# Altium project ESC_type_4_000.PrjPcb
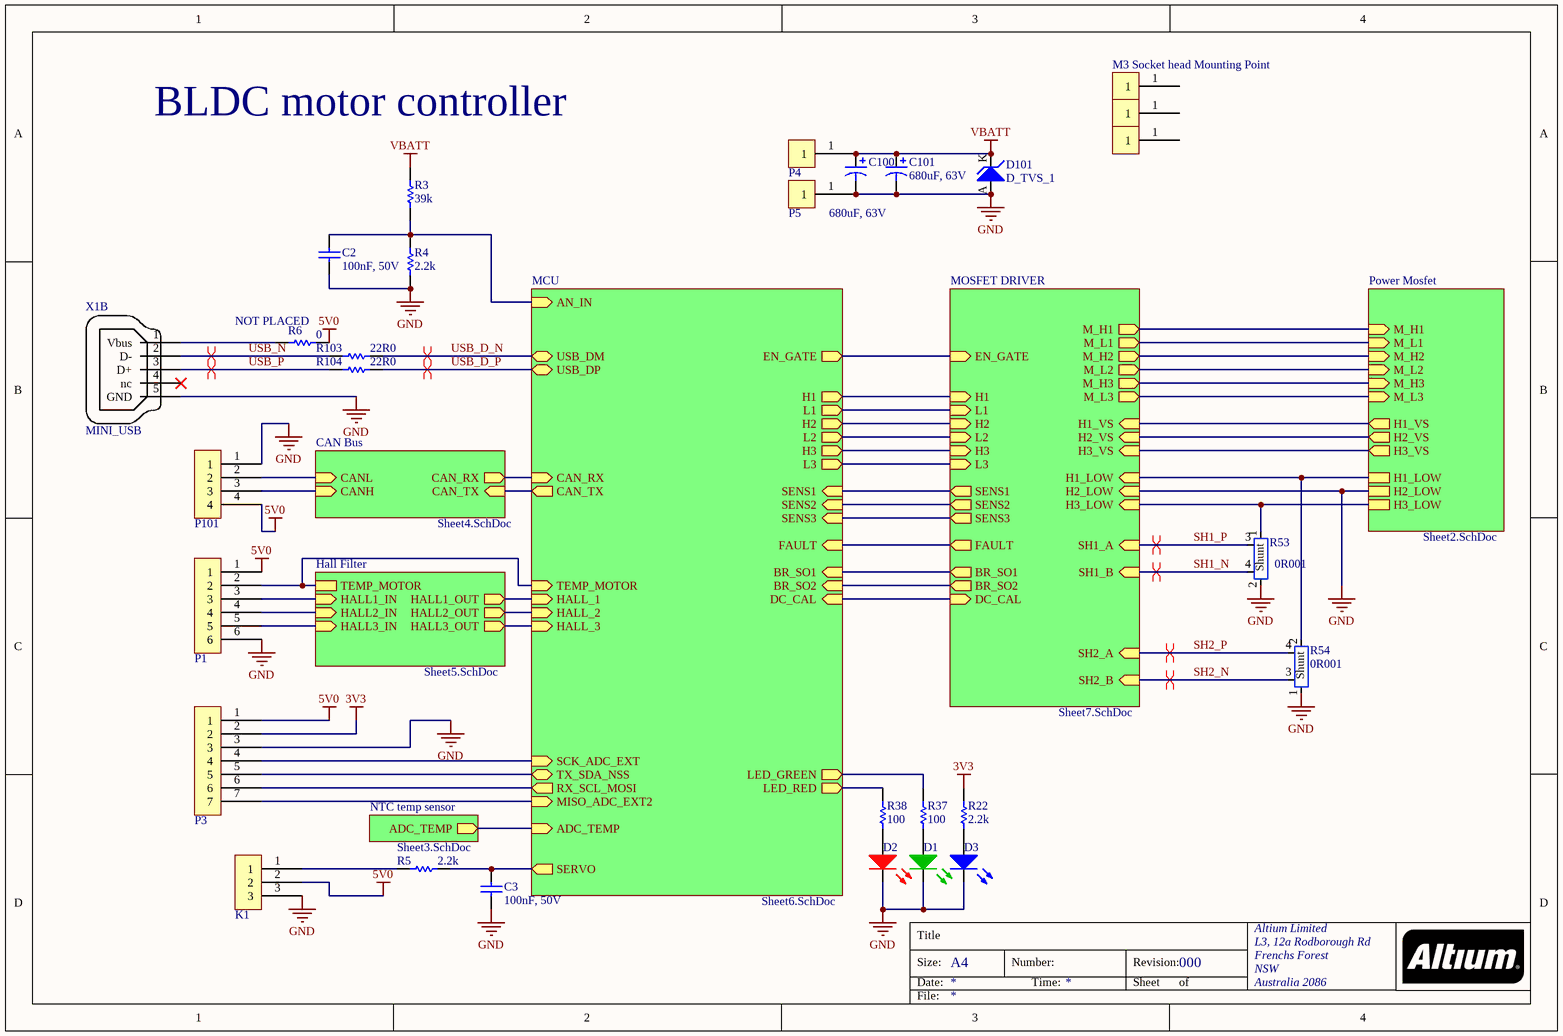
[diagram p0: Sheet1.SchDoc]
Revision: 000
7 sheets, 132 parts. Net scope: hierarchical (ports join the sheet entries above them; power ports are global).
Board file: ESC_type_4_000.PcbDoc
Sheets:
  Sheet1.SchDoc
    MOSFET DRIVER = Sheet7.SchDoc
    Power Mosfet = Sheet2.SchDoc
    MCU = Sheet6.SchDoc
    NTC temp sensor = Sheet3.SchDoc
    Hall Filter = Sheet5.SchDoc
    CAN Bus = Sheet4.SchDoc

## Sheet Sheet1.SchDoc
size A4; Organization: Altium Limited; Address1: L3, 12a Rodborough Rd; Address2: Frenchs Forest; Address3: NSW; Address4: Australia 2086

### Parts
C2  value 100nF, 50V  [SMD-0603 Capacitor]  (hidden comment: Voltage important)
C3  value 100nF, 50V  [SMD-0603 Capacitor]  (hidden comment: Voltage important)
C100  value 680uF, 63V  [ALU CAP 16DIA 25HIGH]  (hidden comment: CAP_POL)
C101  value 680uF, 63V  [ALU CAP 16DIA 25HIGH]  (hidden comment: CAP_POL)
D1  LED_GREEN  [SMD-0603 LED GREEN]  (value not drawn)
D2  LED_RED  [SMD-0603 LED RED]  (value not drawn)
D3  LED_BLUE  [SMD-0603 LED BLUE]  (value not drawn)
D101  D_TVS_1  [SMC-403-03]
K1  -  [HEADER 3 PIN]  (value not drawn)
M1  M3 Socket head Mounting Point  [M3 Socket head]
M2  M3 Socket head Mounting Point  [M3 Socket head]  (value not drawn)
M3  M3 Socket head Mounting Point  [M3 Socket head]  (value not drawn)
P1  B6B-PH-K-S(LF)(SN)  [JST PH TH VERT 6]  (value not drawn)
P3  B7B-PH-K-S(LF)(SN)  [JST PH TH VERT 7]  (value not drawn)
P4  -  [PAD1]  (value not drawn)
P5  -  [PAD1]  (value not drawn)
P101  B4B-PH-K-S(LF)(SN)  [JST PH TH VERT 4]  (value not drawn)
R3  39k  [SMD-0603 Resistor]
R4  2.2k  [SMD-0603 Resistor]
R5  2.2k  [SMD-0603 Resistor]
R6  0  Place (YES/NO): NOT PLACED  [SMD-0603 Resistor]
R22  2.2k  [SMD-0603 Resistor]
R37  100  [SMD-0603 Resistor]
R38  100  [SMD-0603 Resistor]
R53  0R001  [WSLP2726]
R54  0R001  [WSLP2726]
R103  22R0  [SMD-0603 Resistor]
R104  22R0  [SMD-0603 Resistor]
X1B  MINI_USB  [USB-MICRO B RA SMT-TH]

### Sub-sheets
CAN Bus = Sheet4.SchDoc: CANH (in), CANL (in), CAN_RX (out), CAN_TX (in)
Hall Filter = Sheet5.SchDoc: HALL3_IN (in), HALL2_IN (in), HALL1_IN (in), HALL3_OUT (out), HALL2_OUT (out), HALL1_OUT (out), TEMP_MOTOR
MCU = Sheet6.SchDoc: SENS3 (in), SENS2 (in), SENS1 (in), ADC_TEMP (in), SCK_ADC_EXT (in), MISO_ADC_EXT2 (in), H3 (out), H2 (out), H1 (out), USB_DM (bidir), USB_DP (bidir), BR_SO1 (in), BR_SO2 (in), SERVO (out), HALL_1 (in), HALL_2 (in), CAN_RX (in), CAN_TX (out), DC_CAL (in), L1 (out), L2 (out), L3 (out), TEMP_MOTOR (in), AN_IN (in), LED_GREEN (out), LED_RED (out), TX_SDA_NSS (bidir), RX_SCL_MOSI (out), EN_GATE (out), HALL_3 (in), FAULT (in)
MOSFET DRIVER = Sheet7.SchDoc: FAULT (out), DC_CAL (in), EN_GATE (in), H1 (in), L1 (in), H2 (in), L2 (in), H3 (in), L3 (in), BR_SO1 (out), BR_SO2 (out), M_H1 (out), M_L1 (out), H1_LOW (in), M_H2 (out), H2_VS (in), M_L2 (out), H2_LOW (in), M_H3 (out), H3_VS (in), M_L3 (out), H3_LOW (in), SH1_A (in), SH1_B (in), SH2_A (in), SH2_B (in), SENS1 (out), SENS2 (out), H1_VS (in), SENS3 (out)
NTC temp sensor = Sheet3.SchDoc: ADC_TEMP (out)
Power Mosfet = Sheet2.SchDoc: H1_VS (out), M_H1 (in), M_L1 (in), H1_LOW, H2_VS (out), M_H2 (in), M_L2 (in), H2_LOW, H3_VS (out), M_H3 (in), M_L3 (in), H3_LOW

### Nets
3V3: P3.2 R22.2
5V0: K1.2 P1.1 P3.1 P101.4 R6.2
GND: C2.2 C3.1 C100.2 C101.2 D1.2 D2.2 D3.2 D101.A K1.3 P1.6 P3.3 P5.1 P101.1 R4.1 R53.2 R54.1 X1B.5(GND) ; sheet MOSFET DRIVER/H2_LOW, sheet Power Mosfet/H2_LOW
VBATT: C100.1 C101.1 D101.K P4.1 R3.2
H1_VS: sheet MOSFET DRIVER/H1_VS, sheet Power Mosfet/H1_VS
H2_VS: sheet MOSFET DRIVER/H2_VS, sheet Power Mosfet/H2_VS
H3_VS: sheet MOSFET DRIVER/H3_VS, sheet Power Mosfet/H3_VS
RX_SCL_MOSI: P3.6 ; sheet MCU/RX_SCL_MOSI
SH1_N: R53.4 ; sheet MOSFET DRIVER/SH1_B
SH1_P: R53.3 ; sheet MOSFET DRIVER/SH1_A
SH2_N: R54.3 ; sheet MOSFET DRIVER/SH2_B
SH2_P: R54.4 ; sheet MOSFET DRIVER/SH2_A
TX_SDA_NSS: P3.5 ; sheet MCU/TX_SDA_NSS
USB_D_N: R103.2 ; sheet MCU/USB_DM
USB_D_P: R104.2 ; sheet MCU/USB_DP
USB_N: R103.1 X1B.2(D-)
USB_P: R104.1 X1B.3(D+)
NetC2_1: C2.1 R3.1 R4.2 ; sheet MCU/AN_IN
NetC3_2: C3.2 R5.2 ; sheet MCU/SERVO
NetC4_2: P1.2 ; sheet MCU/TEMP_MOTOR, sheet Hall Filter/TEMP_MOTOR
NetC5_2: sheet MCU/HALL_3, sheet Hall Filter/HALL3_OUT
NetC6_2: sheet MCU/HALL_2, sheet Hall Filter/HALL2_OUT
NetC7_2: sheet MCU/HALL_1, sheet Hall Filter/HALL1_OUT
NetC41_2: sheet MCU/ADC_TEMP, sheet NTC temp sensor/ADC_TEMP
NetC102_2: R54.2 ; sheet MOSFET DRIVER/H1_LOW, sheet Power Mosfet/H1_LOW
NetC106_2: R53.1 ; sheet MOSFET DRIVER/H3_LOW, sheet Power Mosfet/H3_LOW
NetD1_1: D1.1 R37.1
NetD2_1: D2.1 R38.1
NetD3_1: D3.1 R22.1
NetK1_1: K1.1 R5.1
NetP1_3: P1.3 ; sheet Hall Filter/HALL1_IN
NetP1_4: P1.4 ; sheet Hall Filter/HALL2_IN
NetP1_5: P1.5 ; sheet Hall Filter/HALL3_IN
NetP3_4: P3.4 ; sheet MCU/SCK_ADC_EXT
NetP3_7: P3.7 ; sheet MCU/MISO_ADC_EXT2
NetP101_2: P101.2 ; sheet CAN Bus/CANL
NetP101_3: P101.3 ; sheet CAN Bus/CANH
NetR6_1: R6.1 X1B.1(Vbus)
NetR23_1: sheet MOSFET DRIVER/SENS1, sheet MCU/SENS1
NetR26_1: sheet MOSFET DRIVER/SENS2, sheet MCU/SENS2
NetR28_1: sheet MOSFET DRIVER/M_H1, sheet Power Mosfet/M_H1
NetR29_1: sheet MOSFET DRIVER/M_L1, sheet Power Mosfet/M_L1
NetR32_1: sheet MOSFET DRIVER/SENS3, sheet MCU/SENS3
NetR34_1: sheet MOSFET DRIVER/M_H2, sheet Power Mosfet/M_H2
NetR35_1: sheet MOSFET DRIVER/M_L2, sheet Power Mosfet/M_L2
NetR37_2: R37.2 ; sheet MCU/LED_GREEN
NetR38_2: R38.2 ; sheet MCU/LED_RED
NetR42_1: sheet MOSFET DRIVER/M_H3, sheet Power Mosfet/M_H3
NetR43_1: sheet MOSFET DRIVER/M_L3, sheet Power Mosfet/M_L3
NetU1_26: sheet MOSFET DRIVER/BR_SO2, sheet MCU/BR_SO2
NetU1_27: sheet MOSFET DRIVER/BR_SO1, sheet MCU/BR_SO1
NetU1_33: sheet MOSFET DRIVER/DC_CAL, sheet MCU/DC_CAL
NetU1_34: sheet MOSFET DRIVER/L3, sheet MCU/L3
NetU1_35: sheet MOSFET DRIVER/L2, sheet MCU/L2
NetU1_36: sheet MOSFET DRIVER/L1, sheet MCU/L1
NetU1_41: sheet MOSFET DRIVER/H3, sheet MCU/H3
NetU1_42: sheet MOSFET DRIVER/H2, sheet MCU/H2
NetU1_43: sheet MOSFET DRIVER/H1, sheet MCU/H1
NetU1_51: sheet MOSFET DRIVER/EN_GATE, sheet MCU/EN_GATE
NetU1_53: sheet MOSFET DRIVER/FAULT, sheet MCU/FAULT
NetU1_61: sheet MCU/CAN_RX, sheet CAN Bus/CAN_RX
NetU1_62: sheet MCU/CAN_TX, sheet CAN Bus/CAN_TX

Not connected (* = marked no-connect by the designer): M1 1; M2 1; M3 1; X1B 4(nc)*

### Layout directives
differential pair: SH1_N, SH1_P, SH2_N, SH2_P, USB_D_N, USB_D_P, USB_N, USB_P

### Notes on the sheet
- BLDC motor controller
- Title
- Size:
- Date:
- A4
- Number:
- Time:
- Revision:
- Sheet
- of
- File:
- (in symbol 13) Shunt
- (in symbol 14) Shunt

### Library data of the parts
C2 C3 = 7: CAP 100n, 50V, 0603; Manufacturer Part Number: 06035C104JAT2A; Manufacturer: AVX Corporation; ID: 7; Place (YES/NO): YES
C100 C101 = 21: 680µF 63V Aluminum Capacitors Radial; Manufacturer Part Number: UPW1J681MHD; Manufacturer: Nichicon; ID: 21; Place (YES/NO): YES
D1 = 1: LED Green, 0603; Part Number: LTST-C191KGKT; Manufacturer: Lite-On Inc.; ID: 1; Place (YES/NO): YES; Manufacturer Part Number: LTST-C191KGKT
D2 = 2: LED Red, 0603; Part Number: LTST-C191KRKT; Manufacturer: Lite-On Inc.; ID: 2; Place (YES/NO): YES; Manufacturer Part Number: LTST-C191KRKT
D3 = 3: LED Blue, 0603; Part Number: LBQ39GN1P1351; Manufacturer: OSRAM; ID: 3; Place (YES/NO): YES; Manufacturer Part Number: LBQ39GN1P1351
D101 = 16: TVS DIODE 51VWM 82.4VC SMC; Manufacturer Part Number: SMCJ51A; Manufacturer: ON Semiconductor; ID: 16; Value: 51V; Place (YES/NO): YES
K1 = 6: Breakaway 3 pin Through hole; ID: 6; Place (YES/NO): YES; Manufacturer Part Number: -; Manufacturer: -
M1-M3 = 1: ID: 1; Place (YES/NO): yes; Value: M3
P1 = 3: JST PH Through hole Vertical 6 Pin; ID: 3; Value: JST PH 6 PIN; Place (YES/NO): YES; Manufacturer Part Number: B6B-PH-K-S(LF)(SN); Manufacturer: JST
P3 = 4: JST PH Through hole Vertical 7 Pin; ID: 4; Value: JST PH 4 PIN; Place (YES/NO): YES; Manufacturer Part Number: B7B-PH-K-S(LF)(SN); Manufacturer: JST
P4 P5 = 1: SMD Power landing; ID: 1; Value: -; Place (YES/NO): -; Manufacturer Part Number: -; Manufacturer: -
P101 = 2: JST PH Through hole Vertical 4 Pin; ID: 2; Value: JST PH 4 PIN; Place (YES/NO): YES; Manufacturer Part Number: B4B-PH-K-S(LF)(SN); Manufacturer: JST
R3 = 8: R 39k, 0603; Manufacturer Part Number: ERJ-3EKF3902V; Manufacturer: Panasonic Electronic Components; ID: 8; Place (YES/NO): YES; Value: 39k
R4 R5 R22 = 3: R 2.2k, 0603; Manufacturer Part Number: RK73H1JTTD2201F; Manufacturer: KOA Speer; ID: 3; Place (YES/NO): YES; Value: 2.2k
R6 = 16: R 0 ohm, 0603; Manufacturer: KOA Speer; ID: 16; Value: 0
R37 R38 = 2: R 100ohm, 0603; Manufacturer Part Number: RK73H1JTTD1000F; Manufacturer: KOA Speer; ID: 2; Place (YES/NO): YES; Value: 100
R53 = 13: Shunt 1mOhm; Manufacturer Part Number: WSLP27261L000FEA; Manufacturer: Vishay Dale; ID: 13; Place (YES/NO): YES; Value: 0R001
R54 = 14: Shunt 1mOhm MIRROR; Manufacturer Part Number: WSLP27261L000FEA; Manufacturer: Vishay Dale; ID: 14; Place (YES/NO): YES; Value: 0R001
R103 R104 = 12: R 22R, 0603; Manufacturer Part Number: RK73H1JTTD22R0F; Manufacturer: KOA Speer; ID: 12; Place (YES/NO): YES; Value: 22R0
X1B = 39: CONN USB MICRO B RECPT SMT R/A TH; Manufacturer Part Number: 10118194-0001LF; Manufacturer: Amphenol FCI; ID: 39; Value: Micro-USB; Place (YES/NO): YES

## Sheet Sheet7.SchDoc
size A4; Organization: Altium Limited; Address1: L3, 12a Rodborough Rd; Address2: Frenchs Forest; Address3: NSW; Address4: Australia 2086
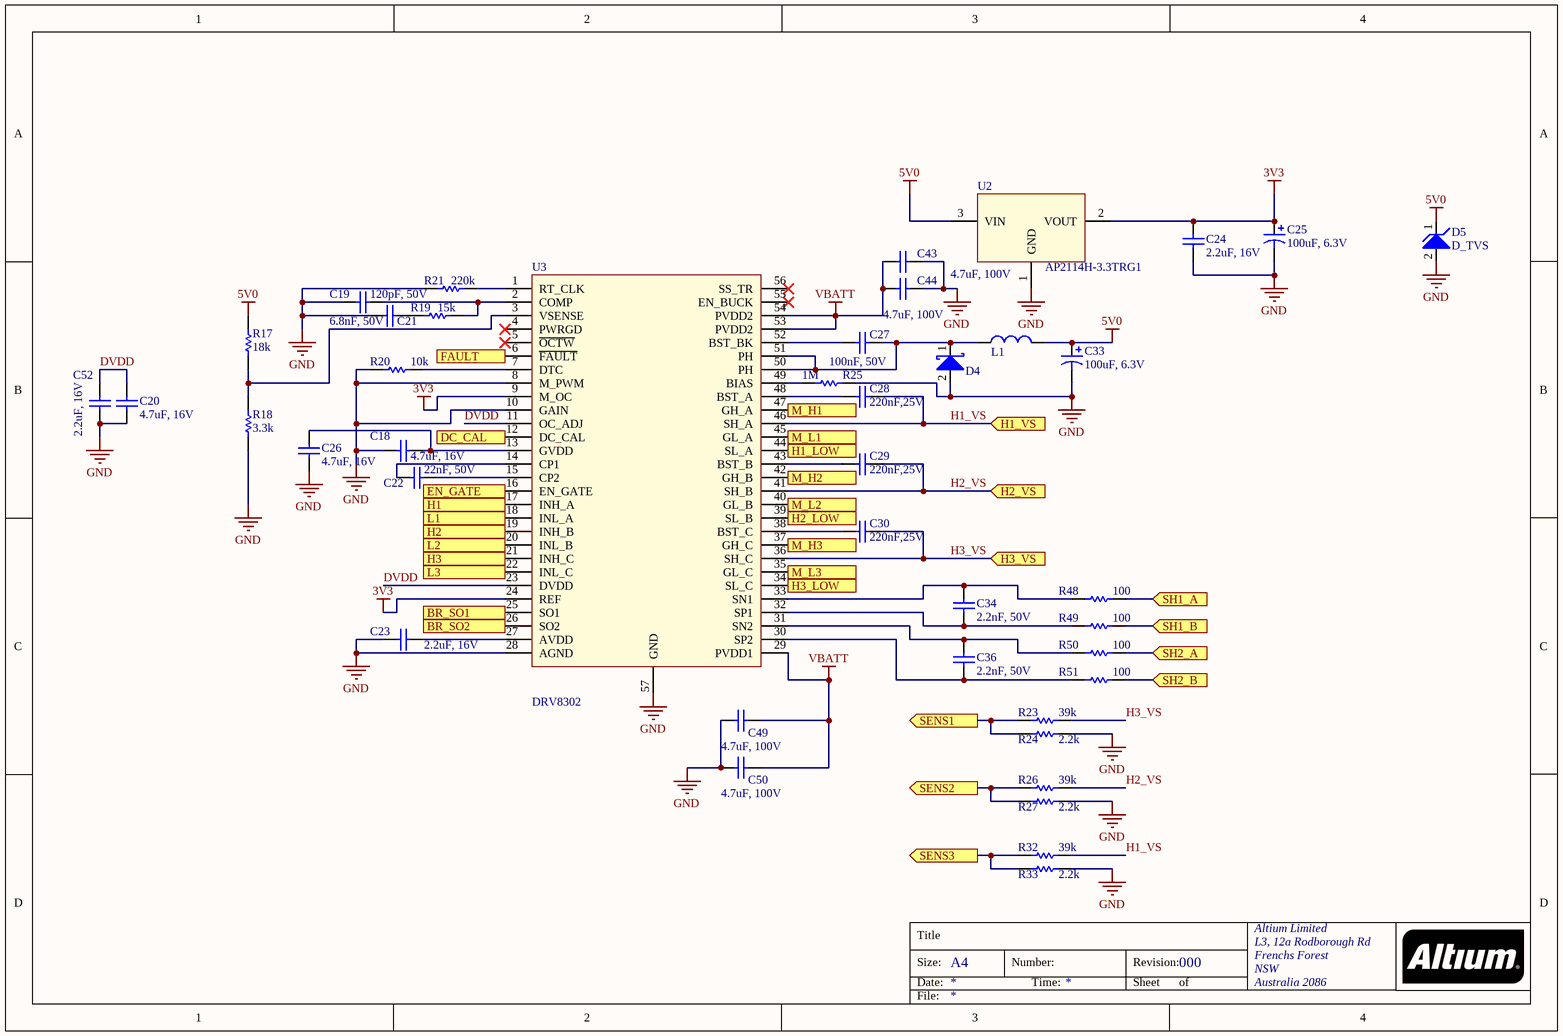
[diagram p1: Sheet7.SchDoc]

### Parts
C18  value 4.7uF, 16V  [SMD-0603 Capacitor]  (hidden comment: CAP)
C19  value 120pF, 50V  [SMD-0603 Capacitor]  (hidden comment: CAP)
C20  value 4.7uF, 16V  [SMD-0603 Capacitor]  (hidden comment: CAP)
C21  value 6.8nF, 50V  [SMD-0603 Capacitor]  (hidden comment: CAP)
C22  value 22nF, 50V  [SMD-0603 Capacitor]  (hidden comment: CAP)
C23  value 2.2uF, 16V  [SMD-0603 Capacitor]  (hidden comment: Voltage important)
C24  value 2.2uF, 16V  [SMD-0603 Capacitor]  (hidden comment: Voltage important)
C25  value 100uF, 6.3V  [TANT B]  (hidden comment: Voltage important)
C26  value 4.7uF, 16V  [SMD-0603 Capacitor]  (hidden comment: CAP)
C27  value 100nF, 50V  [SMD-0603 Capacitor]  (hidden comment: Voltage important)
C28  value 220nF,25V  [SMD-0603 Capacitor]  (hidden comment: Voltage important)
C29  value 220nF,25V  [SMD-0603 Capacitor]  (hidden comment: Voltage important)
C30  value 220nF,25V  [SMD-0603 Capacitor]  (hidden comment: Voltage important)
C33  value 100uF, 6.3V  [TANT B]  (hidden comment: Voltage important)
C34  value 2.2nF, 50V  [SMD-0603 Capacitor]  (hidden comment: CAP)
C36  value 2.2nF, 50V  [SMD-0603 Capacitor]  (hidden comment: CAP)
C43  value 4.7uF, 100V  [SMD-1206 Capacitor]  (hidden comment: CAP)
C44  value 4.7uF, 100V  [SMD-1206 Capacitor]  (hidden comment: CAP)
C49  value 4.7uF, 100V  [SMD-1206 Capacitor]  (hidden comment: CAP)
C50  value 4.7uF, 100V  [SMD-1206 Capacitor]  (hidden comment: CAP)
C52  value 2.2uF, 16V  [SMD-0603 Capacitor]  (hidden comment: Voltage important)
D4  Voltage and current important  [SOD-123W]  (value not drawn)
D5  D_TVS  [DO-214AC]
L1  COIL  [HCM0503]  (value not drawn)
R17  18k  [SMD-0603 Resistor]
R18  3.3k  [SMD-0603 Resistor]
R19  15k  [SMD-0603 Resistor]
R20  10k  [SMD-0603 Resistor]
R21  220k  [SMD-0603 Resistor]
R23  39k  [SMD-0603 Resistor]
R24  2.2k  [SMD-0603 Resistor]
R25  1M  [SMD-0603 Resistor]
R26  39k  [SMD-0603 Resistor]
R27  2.2k  [SMD-0603 Resistor]
R32  39k  [SMD-0603 Resistor]
R33  2.2k  [SMD-0603 Resistor]
R48  100  [SMD-0603 Resistor]
R49  100  [SMD-0603 Resistor]
R50  100  [SMD-0603 Resistor]
R51  100  [SMD-0603 Resistor]
U2  Manufacturer Part Number: AP2114H-3.3TRG1  [SOT230P700X180-4N]  (hidden comment: 3.3V)
U3  DRV8302  [SOP127P600-8N]

### Ports
BR_SO1 (out), BR_SO2 (out), DC_CAL (in), EN_GATE (in), FAULT (out), H1 (in), H1_LOW (in), H1_VS (in), H2 (in), H2_LOW (in), H2_VS (in), H3 (in), H3_LOW (in), H3_VS (in), L1 (in), L2 (in), L3 (in), M_H1 (out), M_H2 (out), M_H3 (out), M_L1 (out), M_L2 (out), M_L3 (out), SENS1 (out), SENS2 (out), SENS3 (out), SH1_A (in), SH1_B (in), SH2_A (in), SH2_B (in)

### Nets
3V3: C24.2 C25.1 U2.2(VOUT) U3.9(M_OC) U3.24(REF)
5V0: C33.1 D5.1(K) L1.2 R17.2 U2.3(VIN)
GND: C18.2 C19.1 C20.1 C21.1 C23.1 C24.1 C25.2 C26.1 C33.2 C43.1 C44.1 C49.2 C50.2 C52.1 D4.2(A) D5.2(A) R18.1 R20.1 R21.1 R24.2 R25.2 R27.2 R33.2 U2.1(GND) U3.8(M_PWM) U3.10(GAIN) U3.28(AGND) U3.39(SL_B) U3.57(GND) ; port H2_LOW
VBATT: C43.2 C44.2 C49.1 C50.1 U3.29(PVDD1) U3.53(PVDD2) U3.54(PVDD2)
DVDD: C20.2 C52.2 U3.11(OC_ADJ) U3.23(DVDD)
H1_VS: C28.2 R32.2 U3.46(SH_A) ; port H1_VS
H2_VS: C29.2 R26.2 U3.41(SH_B) ; port H2_VS
H3_VS: C30.2 R23.2 U3.36(SH_C) ; port H3_VS
SH1_N: R49.2 ; port SH1_B
SH1_P: R48.2 ; port SH1_A
SH2_N: R51.2 ; port SH2_B
SH2_P: R50.2 ; port SH2_A
NetC18_1: C18.1 C26.2 U3.13(GVDD)
NetC19_2: C19.2 R19.2 U3.2(COMP)
NetC21_2: C21.2 R19.1
NetC22_1: C22.1 U3.14(CP1)
NetC22_2: C22.2 U3.15(CP2)
NetC23_2: C23.2 U3.27(AVDD)
NetC27_1: C27.1 U3.52(BST_BK)
NetC27_2: C27.2 D4.1(K) L1.1 U3.50(PH) U3.51(PH)
NetC28_1: C28.1 U3.48(BST_A)
NetC29_1: C29.1 U3.43(BST_B)
NetC30_1: C30.1 U3.38(BST_C)
NetC34_1: C34.1 R49.1 U3.32(SP1)
NetC34_2: C34.2 R48.1 U3.33(SN1)
NetC36_1: C36.1 R51.1 U3.30(SP2)
NetC36_2: C36.2 R50.1 U3.31(SN2)
NetC102_2: U3.44(SL_A) ; port H1_LOW
NetC106_2: U3.34(SL_C) ; port H3_LOW
NetR17_1: R17.1 R18.2 U3.3(VSENSE)
NetR20_2: R20.2 U3.7(DTC)
NetR21_2: R21.2 U3.1(RT_CLK)
NetR23_1: R23.1 R24.1 ; port SENS1
NetR25_1: R25.1 U3.49(BIAS)
NetR26_1: R26.1 R27.1 ; port SENS2
NetR28_1: U3.47(GH_A) ; port M_H1
NetR29_1: U3.45(GL_A) ; port M_L1
NetR32_1: R32.1 R33.1 ; port SENS3
NetR34_1: U3.42(GH_B) ; port M_H2
NetR35_1: U3.40(GL_B) ; port M_L2
NetR42_1: U3.37(GH_C) ; port M_H3
NetR43_1: U3.35(GL_C) ; port M_L3
NetU1_26: U3.26(SO2) ; port BR_SO2
NetU1_27: U3.25(SO1) ; port BR_SO1
NetU1_33: U3.12(DC_CAL) ; port DC_CAL
NetU1_34: U3.22(INL_C) ; port L3
NetU1_35: U3.20(INL_B) ; port L2
NetU1_36: U3.18(INL_A) ; port L1
NetU1_41: U3.21(INH_C) ; port H3
NetU1_42: U3.19(INH_B) ; port H2
NetU1_43: U3.17(INH_A) ; port H1
NetU1_51: U3.16(EN_GATE) ; port EN_GATE
NetU1_53: U3.6(~{FAULT}) ; port FAULT

Not connected (* = marked no-connect by the designer): U3 4(PWRGD)* 5(~{OCTW})* 55(EN_BUCK)* 56(SS_TR)*

### Notes on the sheet
- Title
- Size:
- Date:
- A4
- Number:
- Time:
- Revision:
- Sheet
- of
- File:

### Library data of the parts
C18 C20 C26 = 25: CAP 4.7u, 16V, 0603; Manufacturer Part Number: C1608X6S1C475K080AC; Manufacturer: TDK Corporation; ID: 25; Place (YES/NO): YES
C19 = 4: CAP 120p, 50V, 0603; Manufacturer Part Number: GRM39C121J50; Manufacturer: Murata Electronics North America; ID: 4; Place (YES/NO): YES
C21 = 5: CAP 6.8n, 50V, 0603; Manufacturer Part Number: GRM18R71H682KA01J; Manufacturer: Murata Electronics North America; ID: 5; Place (YES/NO): YES
C22 = 6: CAP 22n, 50V, 0603; Manufacturer Part Number: GRM18F51H223ZA01D; Manufacturer: Murata Electronics North America; ID: 6; Place (YES/NO): YES
C23 C24 C52 = 9: CAP 2.2u, 16V, 0603; Manufacturer Part Number: C1608X5R1C225M; Manufacturer: TDK Corporation; ID: 9; Place (YES/NO): YES
C25 C33 = 12: CAP 100u, 6.3V; Manufacturer Part Number: TPSB107K006R0400; Manufacturer: AVX Corporation; ID: 12; Place (YES/NO): YES
C27 = 7: as C2 on sheet Sheet1
C28-C30 = 8: CAP 220n, 25V, 0603; Manufacturer Part Number: TMK107B7224KA-T; Manufacturer: Taiyo Yuden; ID: 8; Place (YES/NO): YES
C34 C36 = 2: CAP 2.2n, 50V, 0603; Manufacturer Part Number: GRM39X222J50D; Manufacturer: Murata Electronics North America; ID: 2; Place (YES/NO): YES
C43 C44 C49 C50 = 23: 4.7µF 100V Ceramic Capacitor X7S 1206; Manufacturer Part Number: 12061Z475MAT2A; Manufacturer: AVX Corporation; ID: 23; Place (YES/NO): YES
D4 = 4: Shottky 60V 2A; Manufacturer Part Number: PMEG6020ER-115; Manufacturer: NXP Semiconductors; ID: 4; Place (YES/NO): YES
D5 = 5: TVS diode 5V; Manufacturer Part Number: SMAJ5.0A; Manufacturer: Littelfuse Inc.; ID: 5; Place (YES/NO): YES; Value: 5V
L1 = 7: FIXED IND 22UH 1.9A 270 MOHM SMD; Manufacturer Part Number: HCM0503-220-R; Manufacturer: Eaton; ID: 7; Value: 22µH; Place (YES/NO): YES
R17 = 7: R 18k, 0603; Manufacturer Part Number: RK73H1JTTD1802F; Manufacturer: KOA Speer; ID: 7; Place (YES/NO): YES; Value: 18k
R18 = 4: R 3.3k, 0603; Manufacturer Part Number: RK73H1JTTD3301F; Manufacturer: KOA Speer; ID: 4; Place (YES/NO): YES; Value: 3.3k
R19 = 6: R 15k, 0603; Manufacturer Part Number: RK73H1JTTD1502F; Manufacturer: KOA Speer; ID: 6; Place (YES/NO): YES; Value: 15k
R20 = 5: R 10k, 0603; Manufacturer Part Number: RK73H1JTTD1002F; Manufacturer: KOA Speer; ID: 5; Place (YES/NO): YES; Value: 10k
R21 = 9: R 220k, 0603; Manufacturer Part Number: RK73H1JTTD2203F; Manufacturer: KOA Speer; ID: 9; Place (YES/NO): YES; Value: 220k
R23 R26 R32 = 8: as R3 on sheet Sheet1; Value: 39k
R24 R27 R33 = 3: as R4 on sheet Sheet1; Value: 2.2k
R25 = 11: R 1M, 0603; Manufacturer Part Number: RK73H1JTTD1004F; Manufacturer: KOA Speer; ID: 11; Place (YES/NO): YES; Value: 1M
R48-R51 = 2: as R37 on sheet Sheet1; Value: 100
U2 = 3: VREG LDO; Manufacturer: Diodes Incorporated; ID: 3; Place (YES/NO): YES; Value: 3.3V
U3 = 2: MOSFET Driver; Manufacturer Part Number: DRV8302DCA; Manufacturer: Texas Instruments; ID: 2; Place (YES/NO): YES; Value: MOSFET Driver

## Sheet Sheet2.SchDoc
size A4; Organization: Altium Limited; Address1: L3, 12a Rodborough Rd; Address2: Frenchs Forest; Address3: NSW; Address4: Australia 2086
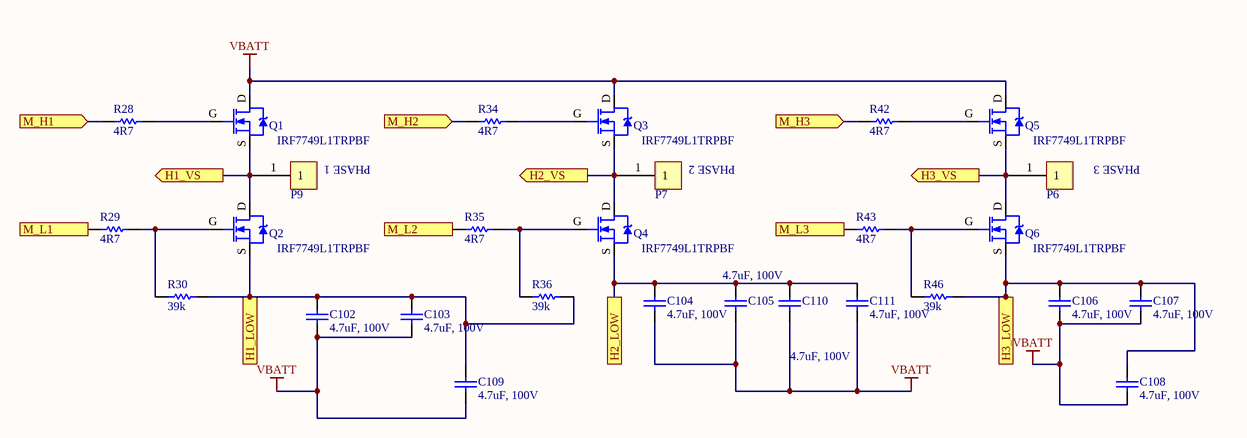
[diagram p2: Sheet2.SchDoc]

### Parts
C102  value 4.7uF, 100V  [SMD-1206 Capacitor]  (hidden comment: CAP)
C103  value 4.7uF, 100V  [SMD-1206 Capacitor]  (hidden comment: CAP)
C104  value 4.7uF, 100V  [SMD-1206 Capacitor]  (hidden comment: CAP)
C105  value 4.7uF, 100V  [SMD-1206 Capacitor]  (hidden comment: CAP)
C106  value 4.7uF, 100V  [SMD-1206 Capacitor]  (hidden comment: CAP)
C107  value 4.7uF, 100V  [SMD-1206 Capacitor]  (hidden comment: CAP)
C108  value 4.7uF, 100V  [SMD-1206 Capacitor]  (hidden comment: CAP)
C109  value 4.7uF, 100V  [SMD-1206 Capacitor]  (hidden comment: CAP)
C110  value 4.7uF, 100V  [SMD-1206 Capacitor]  (hidden comment: CAP)
C111  value 4.7uF, 100V  [SMD-1206 Capacitor]  (hidden comment: CAP)
P6  -  [PAD1]  (value not drawn)
P7  -  [PAD1]  (value not drawn)
P9  -  [PAD1]  (value not drawn)
Q1  Manufacturer Part Number: IRF7749L1TRPBF  [DIRECTFET_1]  (hidden comment: MOSFET_N)
Q2  Manufacturer Part Number: IRF7749L1TRPBF  [DIRECTFET_1]  (hidden comment: MOSFET_N)
Q3  Manufacturer Part Number: IRF7749L1TRPBF  [DIRECTFET_1]  (hidden comment: MOSFET_N)
Q4  Manufacturer Part Number: IRF7749L1TRPBF  [DIRECTFET_1]  (hidden comment: MOSFET_N)
Q5  Manufacturer Part Number: IRF7749L1TRPBF  [DIRECTFET_1]  (hidden comment: MOSFET_N)
Q6  Manufacturer Part Number: IRF7749L1TRPBF  [DIRECTFET_1]  (hidden comment: MOSFET_N)
R28  4R7  [SMD-0603 Resistor]
R29  4R7  [SMD-0603 Resistor]
R30  39k  [SMD-0603 Resistor]
R34  4R7  [SMD-0603 Resistor]
R35  4R7  [SMD-0603 Resistor]
R36  39k  [SMD-0603 Resistor]
R42  4R7  [SMD-0603 Resistor]
R43  4R7  [SMD-0603 Resistor]
R46  39k  [SMD-0603 Resistor]

### Ports
H1_LOW, H1_VS (out), H2_LOW, H2_VS (out), H3_LOW, H3_VS (out), M_H1 (in), M_H2 (in), M_H3 (in), M_L1 (in), M_L2 (in), M_L3 (in)

### Nets
GND: C104.2 C105.2 C110.2 C111.2 Q4.S ; port H2_LOW
VBATT: C102.1 C103.1 C104.1 C105.1 C106.1 C107.1 C108.1 C109.1 C110.1 C111.1 Q1.D Q3.D Q5.D
H1_VS: P9.1 Q1.S Q2.D ; port H1_VS
H2_VS: P7.1 Q3.S Q4.D ; port H2_VS
H3_VS: P6.1 Q5.S Q6.D ; port H3_VS
NetC102_2: C102.2 C103.2 C109.2 Q2.S R30.2 R36.2 ; port H1_LOW
NetC106_2: C106.2 C107.2 C108.2 Q6.S R46.2 ; port H3_LOW
NetQ1_G: Q1.G R28.2
NetQ2_G: Q2.G R29.2 R30.1
NetQ3_G: Q3.G R34.2
NetQ4_G: Q4.G R35.2 R36.1
NetQ5_G: Q5.G R42.2
NetQ6_G: Q6.G R43.2 R46.1
NetR28_1: R28.1 ; port M_H1
NetR29_1: R29.1 ; port M_L1
NetR34_1: R34.1 ; port M_H2
NetR35_1: R35.1 ; port M_L2
NetR42_1: R42.1 ; port M_H3
NetR43_1: R43.1 ; port M_L3

### Notes on the sheet
- (near P9) PHASE 1
- (near P7) PHASE 2
- (near P6) PHASE 3
- Title
- Size:
- Date:
- A4
- Number:
- Time:
- Revision:
- Sheet
- of
- File:
- (in symbol 3) NET TIE
- (in symbol 28) Shunt

### Library data of the parts
C102-C111 = 23: as C43 on sheet Sheet7
P6 P7 P9 = 1: SMD Power landing; ID: 1; Value: -; Place (YES/NO): -; Manufacturer Part Number: -; Manufacturer: -
Q1-Q6 = 10: MOSFET N-CH 60V 200A DIRECTFETL8; Manufacturer: Infineon Technologies Americas Corp; ID: 10; Place (YES/NO): YES
R28 R29 R34 R35 R42 R43 = 1: R 4.7ohm, 0603; Manufacturer Part Number: RK73H1JTTD4R70F; Manufacturer: KOA Speer; ID: 1; Place (YES/NO): YES; Value: 4R7
R30 R36 R46 = 8: as R3 on sheet Sheet1; Value: 39k

## Sheet Sheet6.SchDoc
size A4; Organization: Altium Limited; Address1: L3, 12a Rodborough Rd; Address2: Frenchs Forest; Address3: NSW; Address4: Australia 2086
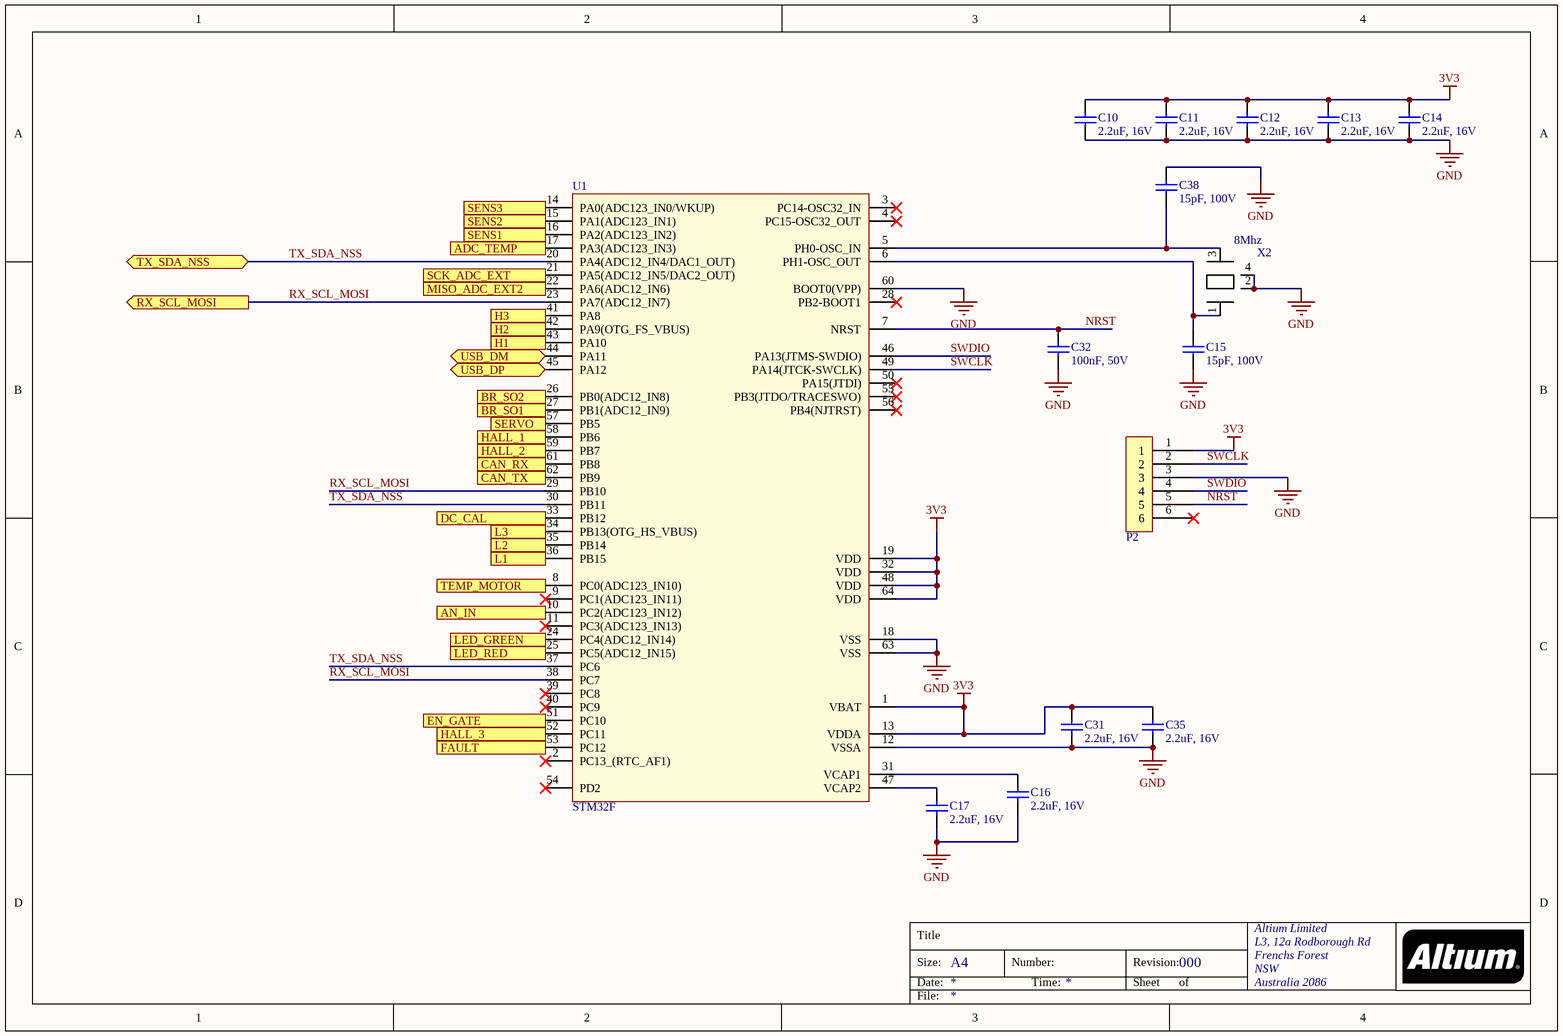
[diagram p3: Sheet6.SchDoc]

### Parts
C10  value 2.2uF, 16V  [SMD-0603 Capacitor]  (hidden comment: Voltage important)
C11  value 2.2uF, 16V  [SMD-0603 Capacitor]  (hidden comment: Voltage important)
C12  value 2.2uF, 16V  [SMD-0603 Capacitor]  (hidden comment: Voltage important)
C13  value 2.2uF, 16V  [SMD-0603 Capacitor]  (hidden comment: Voltage important)
C14  value 2.2uF, 16V  [SMD-0603 Capacitor]  (hidden comment: Voltage important)
C15  value 15pF, 100V  [SMD-0603 Capacitor]  (hidden comment: CAP)
C16  value 2.2uF, 16V  [SMD-0603 Capacitor]  (hidden comment: Voltage important)
C17  value 2.2uF, 16V  [SMD-0603 Capacitor]  (hidden comment: Voltage important)
C31  value 2.2uF, 16V  [SMD-0603 Capacitor]  (hidden comment: Voltage important)
C32  value 100nF, 50V  [SMD-0603 Capacitor]  (hidden comment: Voltage important)
C35  value 2.2uF, 16V  [SMD-0603 Capacitor]  (hidden comment: Voltage important)
C38  value 15pF, 100V  [SMD-0603 Capacitor]  (hidden comment: CAP)
P2  B6B-PH-K-S(LF)(SN)  [JST PH TH VERT 6]  (value not drawn)
U1  STM32F  [TSQFP50P1200X1200X160-64]
X2  value 8Mhz  [4-SMD CRYSTAL 5X3.2mm]  (hidden comment: OSC_1)

### Ports
ADC_TEMP (in), AN_IN (in), BR_SO1 (in), BR_SO2 (in), CAN_RX (in), CAN_TX (out), DC_CAL (in), EN_GATE (out), FAULT (in), H1 (out), H2 (out), H3 (out), HALL_1 (in), HALL_2 (in), HALL_3 (in), L1 (out), L2 (out), L3 (out), LED_GREEN (out), LED_RED (out), MISO_ADC_EXT2 (in), RX_SCL_MOSI (out), SCK_ADC_EXT (in), SENS1 (in), SENS2 (in), SENS3 (in), SERVO (out), TEMP_MOTOR (in), TX_SDA_NSS (bidir), USB_DM (bidir), USB_DP (bidir)

### Nets
3V3: C10.2 C11.2 C12.2 C13.2 C14.2 C31.2 C35.2 P2.1 U1.1(VBAT) U1.13(VDDA) U1.19(VDD) U1.32(VDD) U1.48(VDD) U1.64(VDD)
GND: C10.1 C11.1 C12.1 C13.1 C14.1 C15.1 C16.1 C17.1 C31.1 C32.1 C35.1 C38.2 P2.3 U1.12(VSSA) U1.18(VSS) U1.60(BOOT0(VPP)) U1.63(VSS) X2.2 X2.4
NRST: C32.2 P2.5 U1.7(NRST)
RX_SCL_MOSI: U1.23(PA7(ADC12_IN7)) U1.29(PB10) U1.38(PC7) ; port RX_SCL_MOSI
SWCLK: P2.2 U1.49(PA14(JTCK-SWCLK))
SWDIO: P2.4 U1.46(PA13(JTMS-SWDIO))
TX_SDA_NSS: U1.20(PA4(ADC12_IN4/DAC1_OUT)) U1.30(PB11) U1.37(PC6) ; port TX_SDA_NSS
USB_D_N: U1.44(PA11) ; port USB_DM
USB_D_P: U1.45(PA12) ; port USB_DP
NetC2_1: U1.10(PC2(ADC123_IN12)) ; port AN_IN
NetC3_2: U1.57(PB5) ; port SERVO
NetC4_2: U1.8(PC0(ADC123_IN10)) ; port TEMP_MOTOR
NetC5_2: U1.52(PC11) ; port HALL_3
NetC6_2: U1.59(PB7) ; port HALL_2
NetC7_2: U1.58(PB6) ; port HALL_1
NetC15_2: C15.2 U1.6(PH1-OSC_OUT) X2.1
NetC16_2: C16.2 U1.31(VCAP1)
NetC17_2: C17.2 U1.47(VCAP2)
NetC38_1: C38.1 U1.5(PH0-OSC_IN) X2.3
NetC41_2: U1.17(PA3(ADC123_IN3)) ; port ADC_TEMP
NetP3_4: U1.21(PA5(ADC12_IN5/DAC2_OUT)) ; port SCK_ADC_EXT
NetP3_7: U1.22(PA6(ADC12_IN6)) ; port MISO_ADC_EXT2
NetR23_1: U1.16(PA2(ADC123_IN2)) ; port SENS1
NetR26_1: U1.15(PA1(ADC123_IN1)) ; port SENS2
NetR32_1: U1.14(PA0(ADC123_IN0/WKUP)) ; port SENS3
NetR37_2: U1.24(PC4(ADC12_IN14)) ; port LED_GREEN
NetR38_2: U1.25(PC5(ADC12_IN15)) ; port LED_RED
NetU1_26: U1.26(PB0(ADC12_IN8)) ; port BR_SO2
NetU1_27: U1.27(PB1(ADC12_IN9)) ; port BR_SO1
NetU1_33: U1.33(PB12) ; port DC_CAL
NetU1_34: U1.34(PB13(OTG_HS_VBUS)) ; port L3
NetU1_35: U1.35(PB14) ; port L2
NetU1_36: U1.36(PB15) ; port L1
NetU1_41: U1.41(PA8) ; port H3
NetU1_42: U1.42(PA9(OTG_FS_VBUS)) ; port H2
NetU1_43: U1.43(PA10) ; port H1
NetU1_51: U1.51(PC10) ; port EN_GATE
NetU1_53: U1.53(PC12) ; port FAULT
NetU1_61: U1.61(PB8) ; port CAN_RX
NetU1_62: U1.62(PB9) ; port CAN_TX

Not connected (* = marked no-connect by the designer): P2 6*; U1 2(PC13_(RTC_AF1))* 3(PC14-OSC32_IN)* 4(PC15-OSC32_OUT)* 9(PC1(ADC123_IN11))* 11(PC3(ADC123_IN13))* 28(PB2-BOOT1)* 39(PC8)* 40(PC9)* 50(PA15(JTDI))* 54(PD2)* 55(PB3(JTDO/TRACESWO))* 56(PB4(NJTRST))*

### Notes on the sheet
- Title
- Size:
- Date:
- A4
- Number:
- Time:
- Revision:
- Sheet
- of
- File:

### Library data of the parts
C10-C14 C16 C17 C31 C35 = 9: as C23 on sheet Sheet7
C15 C38 = 3: CAP 15p, 100V, 0603; Manufacturer Part Number: GRM1885C2A150JA01; Manufacturer: Murata Electronics North America; ID: 3; Place (YES/NO): YES
C32 = 7: as C2 on sheet Sheet1
P2 = 3: as P1 on sheet Sheet1; Manufacturer Part Number: B6B-PH-K-S(LF)(SN); Manufacturer: JST
U1 = 4: IC MCU 32BIT 1MB FLASH 64LQFP; Manufacturer Part Number: STM32F405RGT6; Manufacturer: STMicroelectronics; ID: 4; Place (YES/NO): YES
X2 = 1: Crystal 8MHz, 10PPM; Manufacturer Part Number: ABM3B-8.0-10-1UT; Manufacturer: Abracon LLC; ID: 1; Place (YES/NO): YES

## Sheet Sheet3.SchDoc
size A4; Organization: Altium Limited; Address1: L3, 12a Rodborough Rd; Address2: Frenchs Forest; Address3: NSW; Address4: Australia 2086
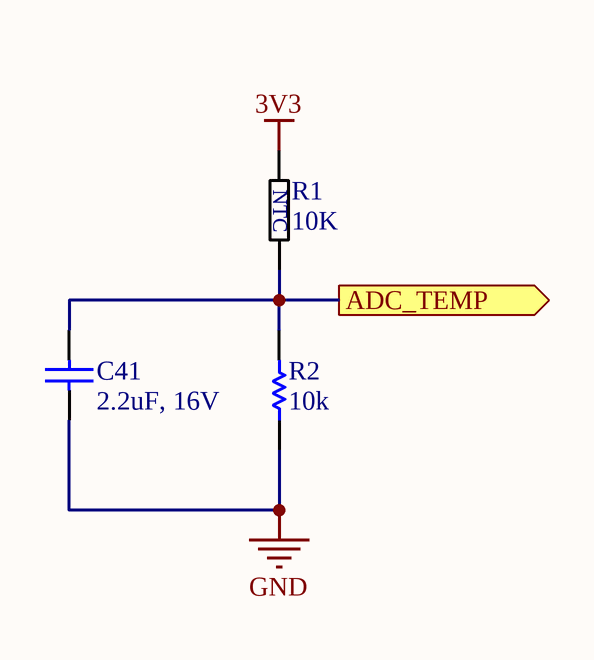
[diagram p4: Sheet3.SchDoc]

### Parts
C41  value 2.2uF, 16V  [SMD-0603 Capacitor]  (hidden comment: Voltage important)
R1  10K  [SMD-0603 Resistor]
R2  10k  [SMD-0603 Resistor]

### Ports
ADC_TEMP (out)

### Nets
3V3: R1.2
GND: C41.1 R2.1
NetC41_2: C41.2 R1.1 R2.2 ; port ADC_TEMP

### Notes on the sheet
- Title
- Size:
- Date:
- A4
- Number:
- Time:
- Revision:
- Sheet
- of
- File:

### Library data of the parts
C41 = 9: as C23 on sheet Sheet7
R1 = 15: NTC resistor (temp sensor); Manufacturer Part Number: NCP18XH103F03RB; Manufacturer: Murata Electronics North America; ID: 15; Place (YES/NO): YES; Value: 10K
R2 = 5: as R20 on sheet Sheet7; Value: 10k

## Sheet Sheet5.SchDoc
size A4; Organization: Altium Limited; Address1: L3, 12a Rodborough Rd; Address2: Frenchs Forest; Address3: NSW; Address4: Australia 2086
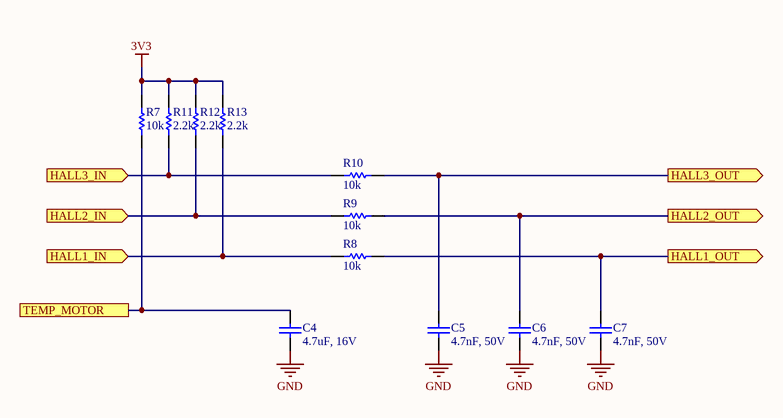
[diagram p5: Sheet5.SchDoc]

### Parts
C4  value 4.7uF, 16V  [SMD-0603 Capacitor]  (hidden comment: CAP)
C5  value 4.7nF, 50V  [SMD-0603 Capacitor]  (hidden comment: CAP)
C6  value 4.7nF, 50V  [SMD-0603 Capacitor]  (hidden comment: CAP)
C7  value 4.7nF, 50V  [SMD-0603 Capacitor]  (hidden comment: CAP)
R7  10k  [SMD-0603 Resistor]
R8  10k  [SMD-0603 Resistor]
R9  10k  [SMD-0603 Resistor]
R10  10k  [SMD-0603 Resistor]
R11  2.2k  [SMD-0603 Resistor]
R12  2.2k  [SMD-0603 Resistor]
R13  2.2k  [SMD-0603 Resistor]

### Ports
HALL1_IN (in), HALL1_OUT (out), HALL2_IN (in), HALL2_OUT (out), HALL3_IN (in), HALL3_OUT (out), TEMP_MOTOR

### Nets
3V3: R7.2 R11.2 R12.2 R13.2
GND: C4.1 C5.1 C6.1 C7.1
NetC4_2: C4.2 R7.1 ; port TEMP_MOTOR
NetC5_2: C5.2 R10.1 ; port HALL3_OUT
NetC6_2: C6.2 R9.1 ; port HALL2_OUT
NetC7_2: C7.2 R8.1 ; port HALL1_OUT
NetP1_3: R8.2 R13.1 ; port HALL1_IN
NetP1_4: R9.2 R12.1 ; port HALL2_IN
NetP1_5: R10.2 R11.1 ; port HALL3_IN

### Notes on the sheet
- Title
- Size:
- Date:
- A4
- Number:
- Time:
- Revision:
- Sheet
- of
- File:

### Library data of the parts
C4 = 25: as C18 on sheet Sheet7
C5-C7 = 1: CAP 4.7n, 50V, 0603; Manufacturer Part Number: GRM39X472J50D; Manufacturer: Murata Electronics North America; ID: 1; Place (YES/NO): YES
R7-R10 = 5: as R20 on sheet Sheet7; Value: 10k
R11-R13 = 3: as R4 on sheet Sheet1; Value: 2.2k

## Sheet Sheet4.SchDoc
size A4; Organization: Altium Limited; Address1: L3, 12a Rodborough Rd; Address2: Frenchs Forest; Address3: NSW; Address4: Australia 2086
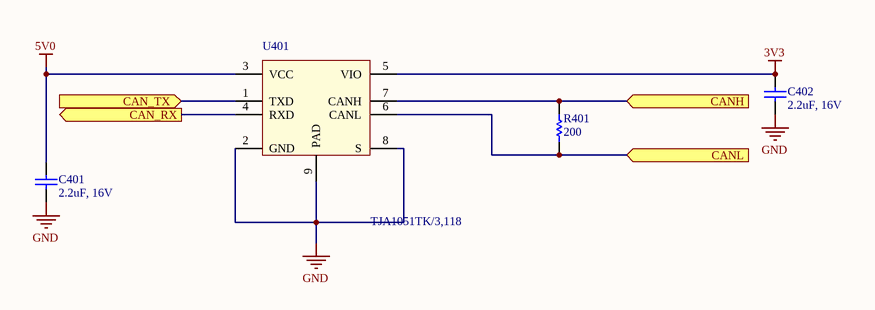
[diagram p6: Sheet4.SchDoc]

### Parts
C401  value 2.2uF, 16V  [SMD-0603 Capacitor]  (hidden comment: Voltage important)
C402  value 2.2uF, 16V  [SMD-0603 Capacitor]  (hidden comment: Voltage important)
R401  200  [SMD-0603 Resistor]
U401  Manufacturer Part Number: TJA1051TK/3,118  [HVSON8]  (hidden comment: CAN_TRANS_1)

### Ports
CAN_RX (out), CAN_TX (in), CANH (in), CANL (in)

### Nets
3V3: C402.2 U401.5(VIO)
5V0: C401.2 U401.3(VCC)
GND: C401.1 C402.1 U401.2(GND) U401.8(S) U401.9(PAD)
NetP101_2: R401.1 U401.6(CANL) ; port CANL
NetP101_3: R401.2 U401.7(CANH) ; port CANH
NetU1_61: U401.4(RXD) ; port CAN_RX
NetU1_62: U401.1(TXD) ; port CAN_TX

### Notes on the sheet
- Title
- Size:
- Date:
- A4
- Number:
- Time:
- Revision:
- Sheet
- of
- File:

### Library data of the parts
C401 C402 = 9: as C23 on sheet Sheet7
R401 = 381: RES SMD 200 OHM 1% 1/10W 0603; Manufacturer Part Number: ERJ-3EKF2000V; Manufacturer: Panasonic Electronic Components; ID: 381; Place (YES/NO): YES; Value: 200
U401 = 20: IC CAN TRANSEIVER HS 8HVSON; Manufacturer: NXP USA Inc.; ID: 20; Value: Transceiver; Place (YES/NO): YES

## Nets that join several sheets
3V3: Sheet1 (P3.2 R22.2), Sheet7 (5 pins), Sheet6 (14 pins), Sheet3 (R1.2), Sheet5 (R7.2 R11.2 R12.2 R13.2), Sheet4 (C402.2 U401.5)
5V0: Sheet1 (5 pins), Sheet7 (5 pins), Sheet4 (C401.2 U401.3)
GND: Sheet1 (17 pins), Sheet7 (29 pins), Sheet2 (5 pins), Sheet6 (19 pins), Sheet3 (C41.1 R2.1), Sheet5 (C4.1 C5.1 C6.1 C7.1), Sheet4 (5 pins)
VBATT: Sheet1 (5 pins), Sheet7 (7 pins), Sheet2 (13 pins)
H1_VS: Sheet7 (C28.2 R32.2 U3.46), Sheet2 (P9.1 Q1.S Q2.D)
H2_VS: Sheet7 (C29.2 R26.2 U3.41), Sheet2 (P7.1 Q3.S Q4.D)
H3_VS: Sheet7 (C30.2 R23.2 U3.36), Sheet2 (P6.1 Q5.S Q6.D)
NetC2_1: Sheet1 (C2.1 R3.1 R4.2), Sheet6 (U1.10)
NetC3_2: Sheet1 (C3.2 R5.2), Sheet6 (U1.57)
NetC4_2: Sheet1 (P1.2), Sheet6 (U1.8), Sheet5 (C4.2 R7.1)
NetC5_2: Sheet6 (U1.52), Sheet5 (C5.2 R10.1)
NetC6_2: Sheet6 (U1.59), Sheet5 (C6.2 R9.1)
NetC7_2: Sheet6 (U1.58), Sheet5 (C7.2 R8.1)
NetC41_2: Sheet6 (U1.17), Sheet3 (C41.2 R1.1 R2.2)
NetC102_2: Sheet1 (R54.2), Sheet7 (U3.44), Sheet2 (6 pins)
NetC106_2: Sheet1 (R53.1), Sheet7 (U3.34), Sheet2 (5 pins)
NetP1_3: Sheet1 (P1.3), Sheet5 (R8.2 R13.1)
NetP1_4: Sheet1 (P1.4), Sheet5 (R9.2 R12.1)
NetP1_5: Sheet1 (P1.5), Sheet5 (R10.2 R11.1)
NetP3_4: Sheet1 (P3.4), Sheet6 (U1.21)
NetP3_7: Sheet1 (P3.7), Sheet6 (U1.22)
NetP101_2: Sheet1 (P101.2), Sheet4 (R401.1 U401.6)
NetP101_3: Sheet1 (P101.3), Sheet4 (R401.2 U401.7)
NetR23_1: Sheet7 (R23.1 R24.1), Sheet6 (U1.16)
NetR26_1: Sheet7 (R26.1 R27.1), Sheet6 (U1.15)
NetR28_1: Sheet7 (U3.47), Sheet2 (R28.1)
NetR29_1: Sheet7 (U3.45), Sheet2 (R29.1)
NetR32_1: Sheet7 (R32.1 R33.1), Sheet6 (U1.14)
NetR34_1: Sheet7 (U3.42), Sheet2 (R34.1)
NetR35_1: Sheet7 (U3.40), Sheet2 (R35.1)
NetR37_2: Sheet1 (R37.2), Sheet6 (U1.24)
NetR38_2: Sheet1 (R38.2), Sheet6 (U1.25)
NetR42_1: Sheet7 (U3.37), Sheet2 (R42.1)
NetR43_1: Sheet7 (U3.35), Sheet2 (R43.1)
NetU1_26: Sheet7 (U3.26), Sheet6 (U1.26)
NetU1_27: Sheet7 (U3.25), Sheet6 (U1.27)
NetU1_33: Sheet7 (U3.12), Sheet6 (U1.33)
NetU1_34: Sheet7 (U3.22), Sheet6 (U1.34)
NetU1_35: Sheet7 (U3.20), Sheet6 (U1.35)
NetU1_36: Sheet7 (U3.18), Sheet6 (U1.36)
NetU1_41: Sheet7 (U3.21), Sheet6 (U1.41)
NetU1_42: Sheet7 (U3.19), Sheet6 (U1.42)
NetU1_43: Sheet7 (U3.17), Sheet6 (U1.43)
NetU1_51: Sheet7 (U3.16), Sheet6 (U1.51)
NetU1_53: Sheet7 (U3.6), Sheet6 (U1.53)
NetU1_61: Sheet6 (U1.61), Sheet4 (U401.4)
NetU1_62: Sheet6 (U1.62), Sheet4 (U401.1)
RX_SCL_MOSI: Sheet1 (P3.6), Sheet6 (U1.23 U1.29 U1.38)
SH1_N: Sheet1 (R53.4), Sheet7 (R49.2)
SH1_P: Sheet1 (R53.3), Sheet7 (R48.2)
SH2_N: Sheet1 (R54.3), Sheet7 (R51.2)
SH2_P: Sheet1 (R54.4), Sheet7 (R50.2)
TX_SDA_NSS: Sheet1 (P3.5), Sheet6 (U1.20 U1.30 U1.37)
USB_D_N: Sheet1 (R103.2), Sheet6 (U1.44)
USB_D_P: Sheet1 (R104.2), Sheet6 (U1.45)